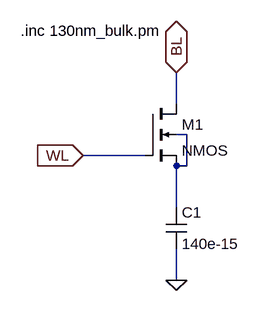
[diagram p0: schematic memory_cell.asc]
memory_cell.asc, the LTspice schematic file:
Version 4
SHEET 1 880 680
WIRE 80 48 80 0
WIRE 96 96 80 96
WIRE 32 128 -64 128
WIRE 96 144 96 96
WIRE 96 144 80 144
WIRE 80 208 80 144
WIRE 80 320 80 272
FLAG 80 320 0
FLAG -64 128 WL
IOPIN -64 128 In
FLAG 80 0 BL
IOPIN 80 0 BiDir
SYMBOL nmos4 32 48 R0
SYMATTR InstName M1
SYMATTR Value2 l=130e-9 w=1300e-9 ad=676000e-18 as=676000e-18 pd=3640e-9 ps=3640e-9
SYMBOL cap 64 208 R0
SYMATTR InstName C1
SYMATTR Value 140e-15
TEXT -160 -64 Left 2 !.inc 130nm_bulk.pm

The netlist it stands for:
* memory_cell.asc
M1 BL WL N001 N001 NMOS l=130e-9 w=1300e-9 ad=676000e-18 as=676000e-18 pd=3640e-9 ps=3640e-9
C1 N001 0 140e-15
.model NMOS NMOS
.model PMOS PMOS
.lib standard.mos
.inc 130nm_bulk.pm
.backanno
.end